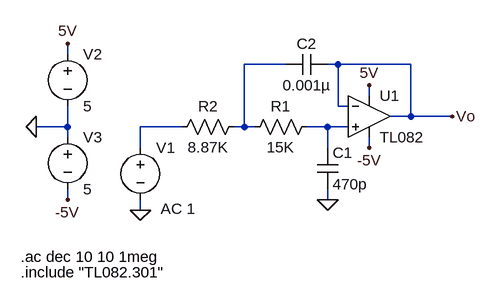
[diagram p0: schematic AC_Analysis.asc]
AC_Analysis.asc, the LTspice schematic file:
Version 4
SHEET 1 880 680
WIRE -208 64 -208 48
WIRE 128 80 64 80
WIRE 208 80 192 80
WIRE 320 80 208 80
WIRE 256 128 256 112
WIRE 208 144 208 80
WIRE 224 144 208 144
WIRE 320 160 320 80
WIRE 320 160 288 160
WIRE 384 160 320 160
WIRE -208 176 -208 144
WIRE -208 176 -256 176
WIRE -32 176 -96 176
WIRE 64 176 64 80
WIRE 64 176 48 176
WIRE 80 176 64 176
WIRE 192 176 160 176
WIRE 224 176 192 176
WIRE -208 192 -208 176
WIRE -96 208 -96 176
WIRE 192 208 192 176
WIRE 256 208 256 192
WIRE -208 288 -208 272
WIRE 192 288 192 272
WIRE -96 304 -96 288
FLAG 192 288 0
FLAG 256 112 5V
FLAG 256 208 -5V
FLAG -208 288 -5V
FLAG -208 48 5V
FLAG -256 176 0
FLAG -96 304 0
FLAG 384 160 Vo
SYMBOL Opamps\\opamp2 256 96 R0
SYMATTR InstName U1
SYMATTR Value TL082
SYMBOL res 176 160 R90
WINDOW 0 0 56 VBottom 2
WINDOW 3 32 56 VTop 2
SYMATTR InstName R1
SYMATTR Value 15K
SYMBOL res 64 160 R90
WINDOW 0 0 56 VBottom 2
WINDOW 3 32 56 VTop 2
SYMATTR InstName R2
SYMATTR Value 8.87K
SYMBOL cap 176 208 R0
SYMATTR InstName C1
SYMATTR Value 470p
SYMBOL cap 192 64 R90
WINDOW 0 0 32 VBottom 2
WINDOW 3 32 32 VTop 2
SYMATTR InstName C2
SYMATTR Value 0.001µ
SYMBOL voltage -96 192 R0
WINDOW 3 31 82 Left 2
WINDOW 123 31 110 Left 2
WINDOW 39 0 0 Left 0
SYMATTR Value ""
SYMATTR Value2 AC 1
SYMATTR InstName V1
SYMBOL voltage -208 48 R0
WINDOW 123 0 0 Left 0
WINDOW 39 0 0 Left 0
SYMATTR InstName V2
SYMATTR Value 5
SYMBOL voltage -208 176 R0
WINDOW 123 0 0 Left 0
WINDOW 39 0 0 Left 0
SYMATTR InstName V3
SYMATTR Value 5
TEXT -280 376 Left 2 !.ac dec 10 10 1meg
TEXT -280 400 Left 2 !.include "TL082.301"

The netlist it stands for:
* AC_Analysis.asc
XU1 N003 Vo 5V -5V Vo TL082  ; pins In+ In- V+ V- OUT
R1 N003 N001 15K
R2 N001 N002 8.87K
C1 N003 0 470p
C2 Vo N001 0.001µ
V1 N002 0 AC 1
V2 5V 0 5
V3 0 -5V 5
.ac dec 10 10 1meg
.include "TL082.301"
.backanno
.end